# Altium project UHF_QM_REV-A.PrjPcb
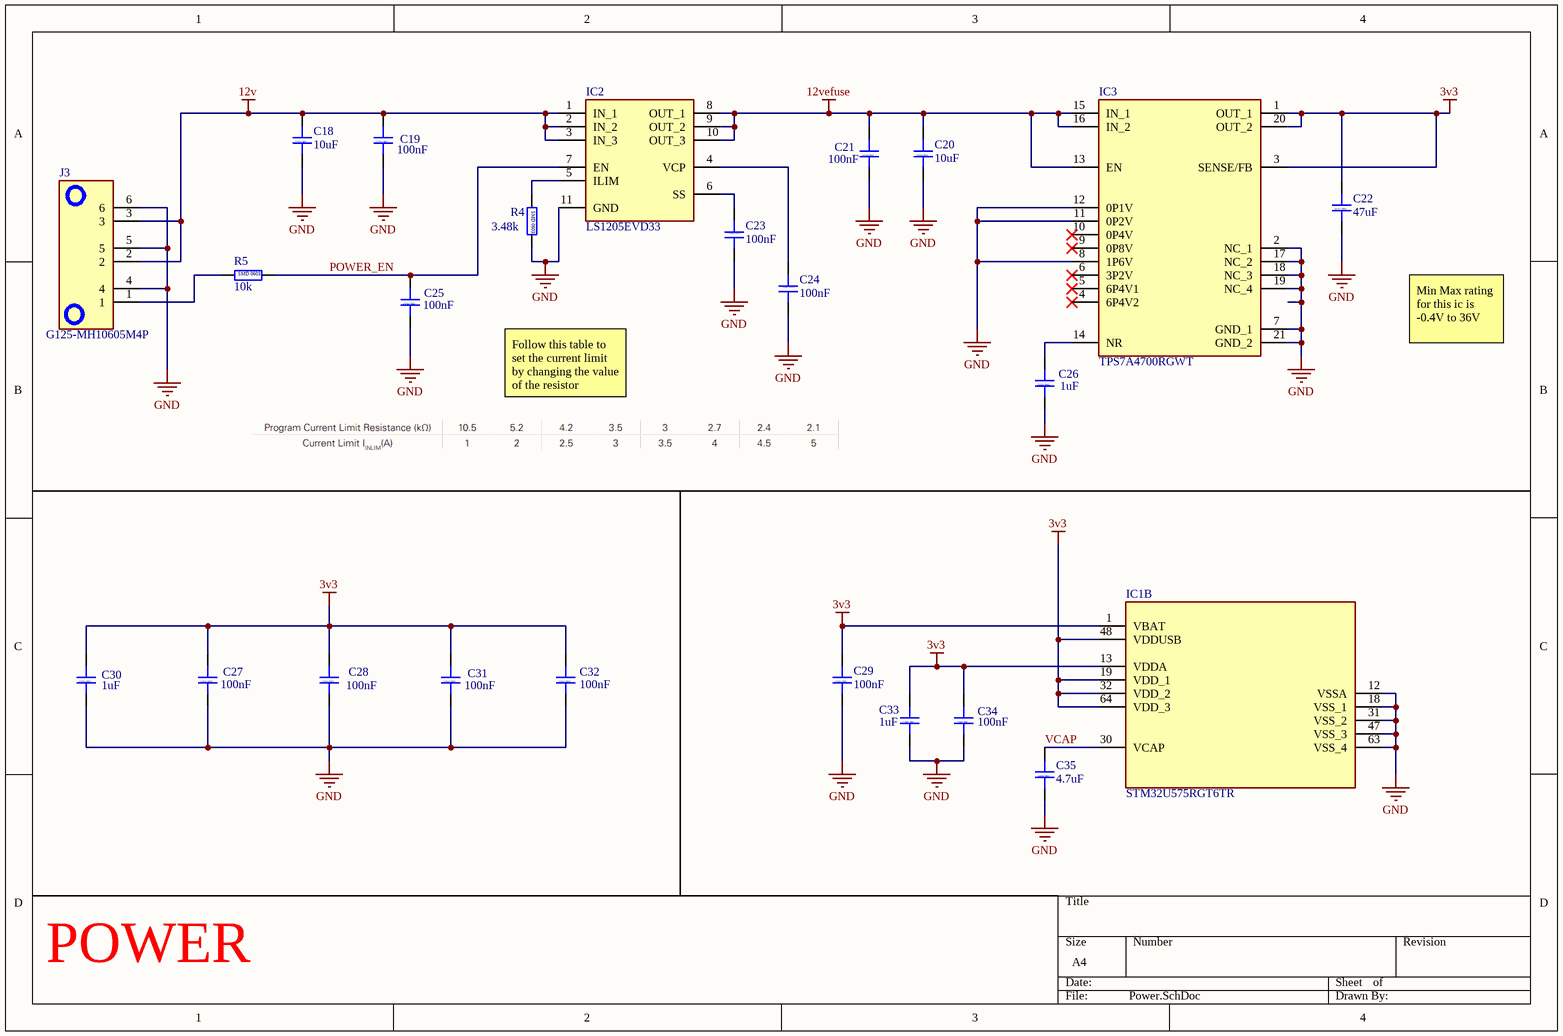
[diagram p0:  Power.SchDoc]
7 sheets, 108 parts. Net scope: global (net labels, ports and power ports of the same name join across sheets).
Board file:  UHF-EM.PcbDoc
Sheets:
   Power.SchDoc
   Stm32.SchDoc
   FlashNTemp.SchDoc
   Si_Chip.SchDoc
   RFnetwork.SchDoc
   RFswitch.SchDoc
   Peripherals.SchDoc

## Sheet  Power.SchDoc
size A4; SheetNumber: 1; SheetTotal: 8

### Parts
C18  10uF  [CAP_0805]
C19  100nF  [CAP_0603]
C20  10uF  [CAP_0805]
C21  100nF  [CAP_0603]
C22  47uF  [CAP_1210]
C23  100nF  [CAP_0603]
C24  100nF  [CAP_0603]
C25  100nF  [CAP_0603]
C26  1uF  [CAP_0603]
C27  100nF  [CAP_0603]
C28  100nF  [CAP_0603]
C29  100nF  [CAP_0603]
C30  1uF  [CAP_0603]
C31  100nF  [CAP_0603]
C32  100nF  [CAP_0603]
C33  1uF  [CAP_0603]
C34  100nF  [CAP_0603]
C35  4.7uF  [CAP_0603]
IC1  STM32U575RGT6TR  [QFP50P1200X1200X160-64N]  (part B of 2)
IC2  LS1205EVD33  [LS1205EVD33]
IC3  TPS7A4700RGWT  [QFN65P500X500X100-21N-D]
J3  G125-MH10605M4P  [G125-MH10605M4P_1]
R4  3.48k  [RES_0603]
R5  10k  [RES_0603]

### Nets
3v3: C22.2 C27.2 C28.2 C29.2 C30.2 C31.2 C32.2 C33.2 C34.2 IC1.1(VBAT) IC1.13(VDDA) IC1.19(VDD_1) IC1.32(VDD_2) IC1.48(VDDUSB) IC1.64(VDD_3) IC3.1(OUT_1) IC3.3(SENSE/FB) IC3.20(OUT_2)
12v: C18.2 C19.2 IC2.1(IN_1) IC2.2(IN_2) IC2.3(IN_3) J3.2 J3.3
12vefuse: C20.2 C21.2 IC2.8(OUT_1) IC2.9(OUT_2) IC2.10(OUT_3) IC3.13(EN) IC3.15(IN_1) IC3.16(IN_2)
GND: C18.1 C19.1 C20.1 C21.1 C22.1 C23.2 C24.2 C25.1 C26.1 C27.1 C28.1 C29.1 C30.1 C31.1 C32.1 C33.1 C34.1 C35.1 IC1.12(VSSA) IC1.18(VSS_1) IC1.31(VSS_2) IC1.47(VSS_3) IC1.63(VSS_4) IC2.11(GND) IC3.2(NC_1) IC3.7(GND_1) IC3.8(1P6V) IC3.11(0P2V) IC3.12(0P1V) IC3.17(NC_2) IC3.18(NC_3) IC3.19(NC_4) IC3.21(GND_2) J3.4 J3.5 J3.6 R4.2
POWER_EN: C25.2 IC2.7(EN) R5.2
VCAP: C35.2 IC1.30(VCAP)
NetC23_1: C23.1 IC2.6(SS)
NetC24_1: C24.1 IC2.4(VCP)
NetC26_2: C26.2 IC3.14(NR)
NetIC2_5: IC2.5(ILIM) R4.1
NetJ3_1: J3.1 R5.1

Not connected (* = marked no-connect by the designer): IC3 4(6P4V2)* 5(6P4V1)* 6(3P2V)* 9(0P8V)* 10(0P4V)*

### Notes on the sheet
- Min Max rating for this ic is -0.4V to 36V
- Follow this table to set the current limit by changing the value of the resistor
- POWER

### Library data of the parts
C18 C20 = Capacitor-SMD-0805: Capacitor SMD 0805 RATED
C19 C21 C23-C35 = Capacitor-SMD-0603: Capacitor SMD 0603 RATED
C22 = Capacitor-SMD-1210: Capacitor SMD 1210 RATED
IC1 = STM32U575RGT6TR: Integrated Circuit; Manufacturer_Name: STMicroelectronics; Datasheet Link: https://www.st.com/resource/en/datasheet/stm32u575ag.pdf; Height: 1.6mm; Manufacturer_Part_Number: STM32U575RGT6TR; Mouser Part Number: 511-STM32U575RGT6TR; Mouser Price/Stock: https://www.mouser.co.uk/ProductDetail/STMicroelectronics/STM32U575RGT6TR?qs=T%252BzbugeAwjjwoz%252BinJLUwQ%3D%3D; Arrow Part Number: STM32U575RGT6TR; Arrow Price/Stock: https://www.arrow.com/en/products/stm32u575rgt6tr/stmicroelectronics?utm_currency=USD&region=nac
IC2 = LS1205EVD33: Integrated Circuit; Manufacturer_Name: LITTELFUSE; Datasheet Link: https://www.littelfuse.com/media?resourcetype=datasheets&itemid=b40a8809-c1ad-459d-a34c-84532dbddcb7&filename=littelfuse-protection-ic-ls1205exd33--datasheet; Height: 0.8mm; Manufacturer_Part_Number: LS1205EVD33; Mouser Part Number: 576-LS1205EVD33; Mouser Price/Stock: https://www.mouser.co.uk/ProductDetail/Littelfuse/LS1205EVD33?qs=4ASt3YYao0VRtislHe5uQQ%3D%3D; Arrow Part Number: LS1205EVD33; Arrow Price/Stock: https://www.arrow.com/en/products/ls1205evd33/littelfuse?utm_currency=USD&region=nac
IC3 = TPS7A4700RGWR: Integrated Circuit; Manufacturer_Name: Texas Instruments; Datasheet Link: http://www.ti.com/lit/gpn/tps7a47; Height: 1mm; Manufacturer_Part_Number: TPS7A4700RGWR; Mouser Part Number: 595-TPS7A4700RGWR; Mouser Price/Stock: https://www.mouser.co.uk/ProductDetail/Texas-Instruments/TPS7A4700RGWR?qs=b5Ofe9I6AaEq0TfoG6v9lA%3D%3D; Arrow Part Number: TPS7A4700RGWR; Arrow Price/Stock: https://www.arrow.com/en/products/tps7a4700rgwr/texas-instruments?region=nac
J3 = G125-MH10605M4P: Connector; Manufacturer_Name: Harwin; Datasheet Link: https://content.harwin.com/m/667f1be9427fb768/original/DRG-02921-Technical-Drawing-Datasheet-G125-MH1XX05M4P-pdf.pdf; Height: 5.3mm; Manufacturer_Part_Number: G125-MH10605M4P; Mouser Part Number: 855-G125MH1065M4PM4P; Mouser Price/Stock: https://www.mouser.co.uk/ProductDetail/Harwin/G125-MH10605M4P?qs=vHuUswq2%252BswF07IXFR1W6A%3D%3D
R4 R5 = Resistor-SMD-0603: Resistor SMD 0603 RATED

## Sheet  Stm32.SchDoc
size A4; SheetNumber: 2; SheetTotal: 8
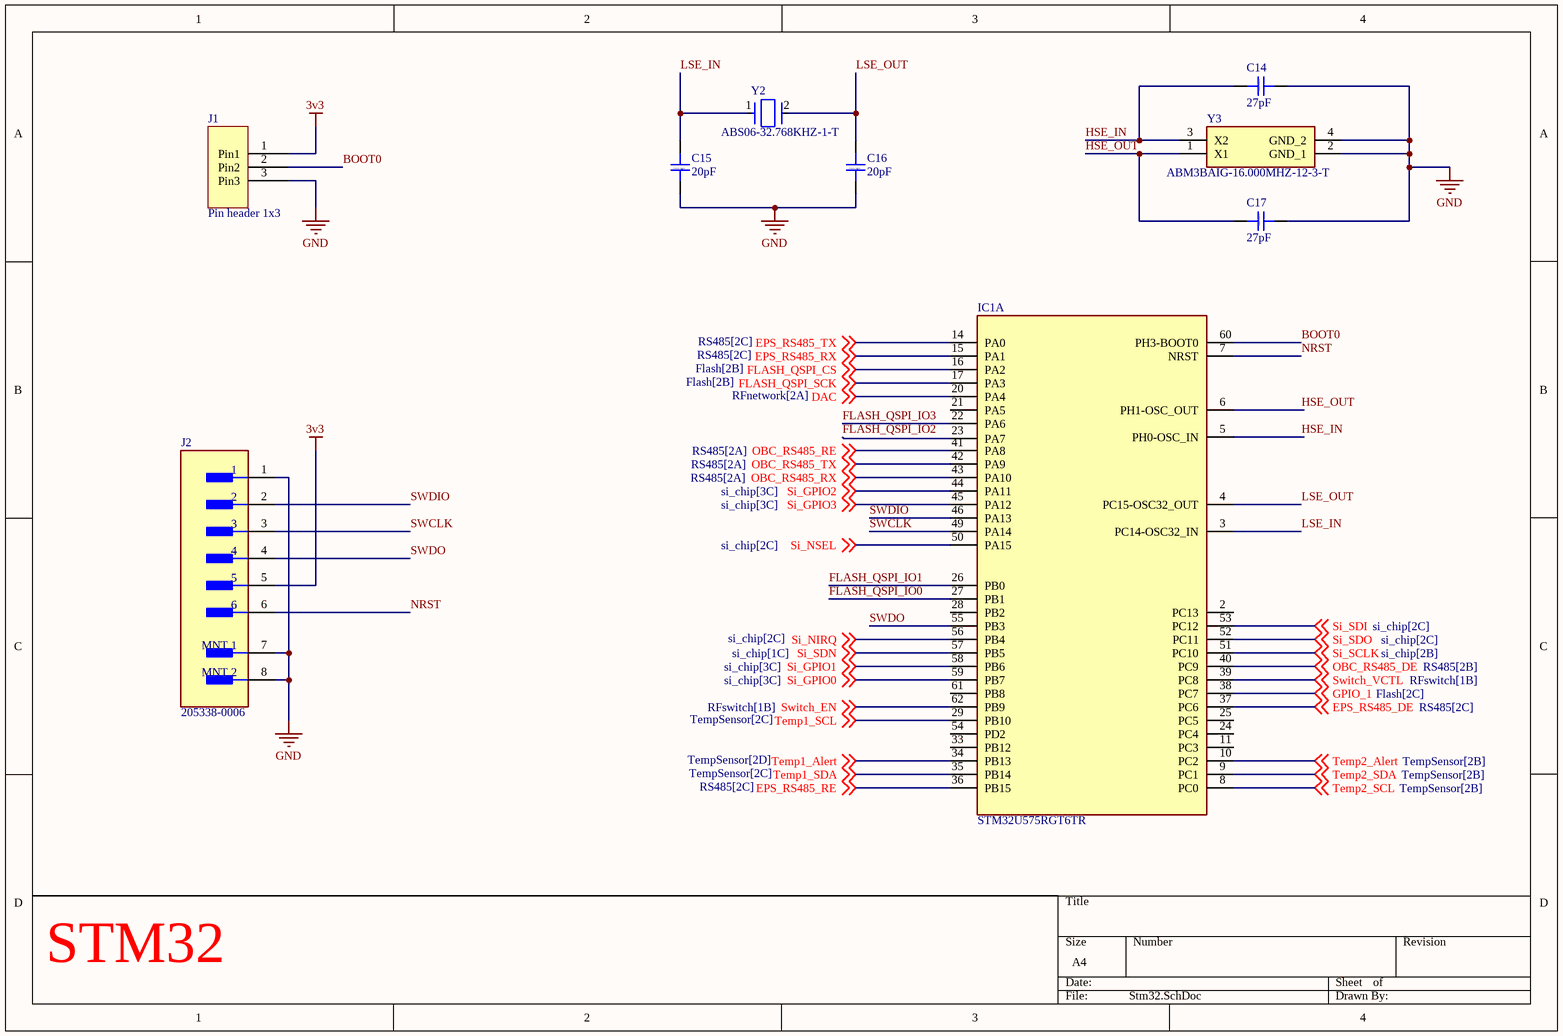
[diagram p1:  Stm32.SchDoc]

### Parts
C14  27pF  [CAP_0603]
C15  20pF  [CAP_0603]
C16  20pF  [CAP_0603]
C17  27pF  [CAP_0603]
IC1  STM32U575RGT6TR  [QFP50P1200X1200X160-64N]  (part A of 2)
J1  Pin header 1x3  [HEADER 3]
J2  205338-0006  [FP-2053380006-MFG]
Y2  ABS06-32.768KHZ-1-T  [FP-ABS06-MFG]
Y3  ABM3BAIG-16.000MHZ-12-3-T  [ABM3BAIG]

### Nets
3v3: J1.1(Pin1) J2.5
GND: C14.2 C15.1 C16.1 C17.2 J1.3(Pin3) J2.1 J2.7(MNT_1) J2.8(MNT_2) Y3.2(GND_1) Y3.4(GND_2)
BOOT0: IC1.60(PH3-BOOT0) J1.2(Pin2)
DAC: IC1.20(PA4) ; off-sheet DAC
EPS_RS485_DE: IC1.37(PC6) ; off-sheet EPS_RS485_DE
EPS_RS485_RE: IC1.36(PB15) ; off-sheet EPS_RS485_RE
EPS_RS485_RX: IC1.15(PA1) ; off-sheet EPS_RS485_RX
EPS_RS485_TX: IC1.14(PA0) ; off-sheet EPS_RS485_TX
FLASH_QSPI_CS: IC1.16(PA2) ; off-sheet FLASH_QSPI_CS
FLASH_QSPI_IO0: IC1.27(PB1)
FLASH_QSPI_IO1: IC1.26(PB0)
FLASH_QSPI_IO2: IC1.23(PA7)
FLASH_QSPI_IO3: IC1.22(PA6)
FLASH_QSPI_SCK: IC1.17(PA3) ; off-sheet FLASH_QSPI_SCK
GPIO_1: IC1.38(PC7) ; off-sheet GPIO_1
HSE_IN: C14.1 IC1.5(PH0-OSC_IN) Y3.3(X2)
HSE_OUT: C17.1 IC1.6(PH1-OSC_OUT) Y3.1(X1)
LSE_IN: C15.2 IC1.3(PC14-OSC32_IN) Y2.1
LSE_OUT: C16.2 IC1.4(PC15-OSC32_OUT) Y2.2
NRST: IC1.7(NRST) J2.6
OBC_RS485_DE: IC1.40(PC9) ; off-sheet OBC_RS485_DE
OBC_RS485_RE: IC1.41(PA8) ; off-sheet OBC_RS485_RE
OBC_RS485_RX: IC1.43(PA10) ; off-sheet OBC_RS485_RX
OBC_RS485_TX: IC1.42(PA9) ; off-sheet OBC_RS485_TX
Si_GPIO0: IC1.59(PB7) ; off-sheet Si_GPIO0
Si_GPIO1: IC1.58(PB6) ; off-sheet Si_GPIO1
Si_GPIO2: IC1.44(PA11) ; off-sheet Si_GPIO2
Si_GPIO3: IC1.45(PA12) ; off-sheet Si_GPIO3
Si_NIRQ: IC1.56(PB4) ; off-sheet Si_NIRQ
Si_NSEL: IC1.50(PA15) ; off-sheet Si_NSEL
Si_SCLK: IC1.51(PC10) ; off-sheet Si_SCLK
Si_SDI: IC1.53(PC12) ; off-sheet Si_SDI
Si_SDN: IC1.57(PB5) ; off-sheet Si_SDN
Si_SDO: IC1.52(PC11) ; off-sheet Si_SDO
SWCLK: IC1.49(PA14) J2.3
SWDIO: IC1.46(PA13) J2.2
SWDO: IC1.55(PB3) J2.4
Switch_EN: IC1.62(PB9) ; off-sheet Switch_EN
Switch_VCTL: IC1.39(PC8) ; off-sheet Switch_VCTL
Temp1_Alert: IC1.34(PB13) ; off-sheet Temp1_Alert
Temp1_SCL: IC1.29(PB10) ; off-sheet Temp1_SCL
Temp1_SDA: IC1.35(PB14) ; off-sheet Temp1_SDA
Temp2_Alert: IC1.10(PC2) ; off-sheet Temp2_Alert
Temp2_SCL: IC1.8(PC0) ; off-sheet Temp2_SCL
Temp2_SDA: IC1.9(PC1) ; off-sheet Temp2_SDA

Not connected (* = marked no-connect by the designer): IC1 2(PC13) 11(PC3) 21(PA5) 24(PC4) 25(PC5) 28(PB2) 33(PB12) 54(PD2) 61(PB8)

### Notes on the sheet
- STM32

### Library data of the parts
C14-C17 = Capacitor-SMD-0603: Capacitor SMD 0603 RATED
IC1 = STM32U575RGT6TR: as IC1 on sheet  Power; Datasheet Link: https://www.st.com/resource/en/datasheet/stm32u575ag.pdf; Height: 1.6mm; Manufacturer_Part_Number: STM32U575RGT6TR; Mouser Part Number: 511-STM32U575RGT6TR; Mouser Price/Stock: https://www.mouser.co.uk/ProductDetail/STMicroelectronics/STM32U575RGT6TR?qs=T%252BzbugeAwjjwoz%252BinJLUwQ%3D%3D; Arrow Part Number: STM32U575RGT6TR; Arrow Price/Stock: https://www.arrow.com/en/products/stm32u575rgt6tr/stmicroelectronics?utm_currency=USD&region=nac
J2 = CMP-00257-108204701-1: 205338-0006 Connector Shrouded Header Positive Lock 6 Position 2mm Pitch Right Angle Surface Mount T/R; Manufacturer Lifecycle Status: ACTIVE; Number of Circuits: 6; Gender: Male; NexarPartId: 108204701; Contact Plating: Gold; Lifecycle Status: Production; Schedule B: 8536694040; RoHS: Compliant; Number of Rows: 1; Country of Origin: MY; Orientation: Right Angle
Y2 = CMP-27762-012387-2: CRYSTAL 32.7680KHZ 12.5PF SMD; Series Resistance: 90kR; Frequency Tolerance: 10ppm; Number of Pins: 2; Max Operating Temperature: 85°C; Load Capacitance: 12.5pF; Series: ABS06; Depth: 1.2mm; Height: 0.6mm; Min Operating Temperature: -40°C; Mount: Surface Mount; Lead Free: Lead Free; Width: 1.2mm; Frequency: 32.768kHz; ESR (Equivalent Series Resistance): 90kR; Termination: SMD/SMT; Packaging: Tape and Reel; RoHS Compliant: Yes; REACH SVHC: No SVHC; Operating Frequency: 32.768 kHz; Case/Package: CSMD; Package Quantity: 3000; Radiation Hardening: No; Tolerance: 10ppm; Length: 2mm
Y3 = ABM3BAIG-16.000MHZ-12-3-T: Crystal or Oscillator; Manufacturer_Name: ABRACON; Datasheet Link: https://abracon.com/AIGcrystals/ABM3BAIG.pdf; Height: 0.9mm; Manufacturer_Part_Number: ABM3BAIG-16.000MHZ-12-3-T

## Sheet  FlashNTemp.SchDoc
size A4; SheetNumber: 3; SheetTotal: 6
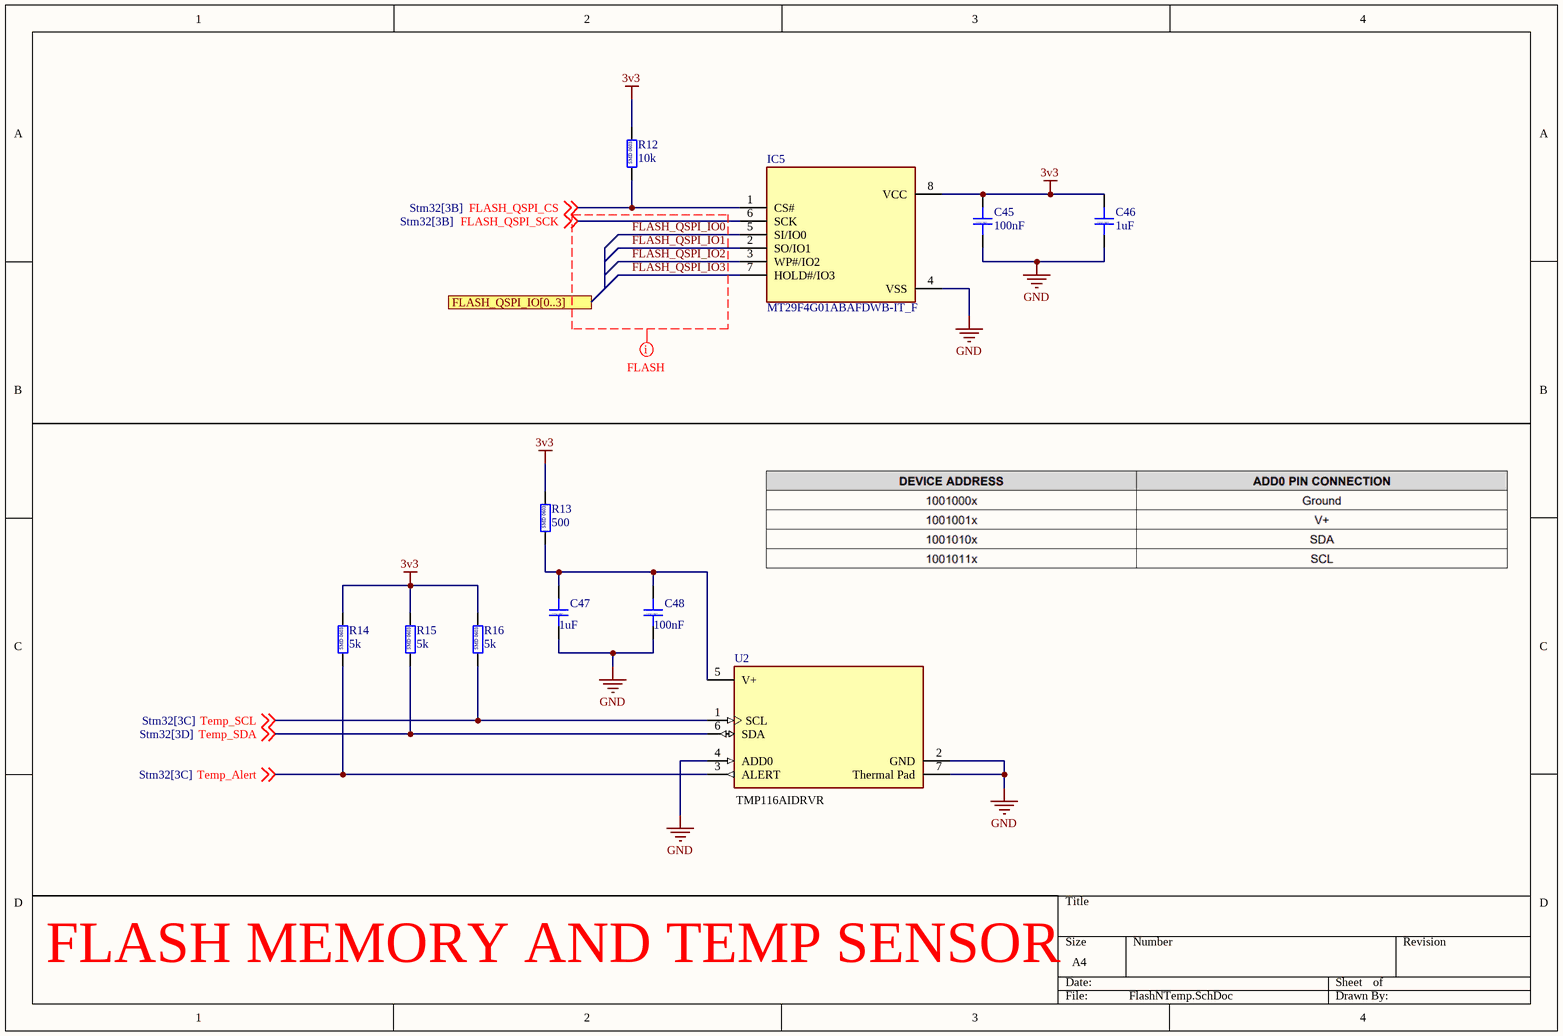
[diagram p2:  FlashNTemp.SchDoc]

### Parts
(Parts that share a designator on the sheet are numbered #1, #2 ... from top to bottom, then left to right.)
C45  100nF  [CAP_0603]
C46  1uF  [CAP_0603]
C47  1uF  [CAP_0603]
C48  100nF  [CAP_0603]
IC5#1  MT29F4G01ABAFDWB-IT_F  [SON127P800X600X65-8N]
R12  10k  [RES_0603]
R13  500  [RES_0603]
R14  5k  [RES_0603]
R15  5k  [RES_0603]
R16  5k  [RES_0603]
U2  (no value)  [FP-DRV0006A-IPC_C]

### Ports
FLASH_QSPI_IO[0..3]

### Nets
3v3: C45.2 C46.2 IC5#1.8(VCC) R12.2 R13.2 R14.2 R15.2 R16.2
GND: C45.1 C46.1 C47.1 C48.1 IC5#1.4(VSS) U2.2(GND) U2.4(ADD0) U2.7(Thermal_Pad)
FLASH_QSPI_CS: IC5#1.1(CS#) R12.1 ; off-sheet FLASH_QSPI_CS
FLASH_QSPI_IO0: IC5#1.5(SI/IO0)
FLASH_QSPI_IO1: IC5#1.2(SO/IO1)
FLASH_QSPI_IO2: IC5#1.3(WP#/IO2)
FLASH_QSPI_IO3: IC5#1.7(HOLD#/IO3)
FLASH_QSPI_SCK: IC5#1.6(SCK) ; off-sheet FLASH_QSPI_SCK
Temp_Alert: R14.1 U2.3(ALERT) ; off-sheet Temp_Alert
Temp_SCL: R16.1 U2.1(SCL) ; off-sheet Temp_SCL
Temp_SDA: R15.1 U2.6(SDA) ; off-sheet Temp_SDA
NetC47_2: C47.2 C48.2 R13.1 U2.5(V+)

### Layout directives
net class FLASH: FLASH_QSPI_IO0, FLASH_QSPI_IO1, FLASH_QSPI_IO2, FLASH_QSPI_IO3, FLASH_QSPI_SCK

### Notes on the sheet
- (near U2) TMP116AIDRVR
- FLASH MEMORY AND TEMP SENSOR

### Library data of the parts
C45-C48 = Capacitor-SMD-0603: Capacitor SMD 0603 RATED
IC5#1 = MT29F4G01ABAFDWB-IT_F: Integrated Circuit; Manufacturer_Name: Micron; Manufacturer_Part_Number: MT29F4G01ABAFDWB-IT:F; Datasheet Link: https://www.farnell.com/datasheets/3151403.pdf; Height: 0.65mm; Mouser Part Number: 340-359563; Mouser Price/Stock: https://www.mouser.co.uk/ProductDetail/Micron/MT29F4G01ABAFDWB-ITF?qs=wUXugUrL1qwrjb7To7JPbA%3D%3D; Arrow Part Number: MT29F4G01ABAFDWB-IT:F; Arrow Price/Stock: null?region=nac
R12-R16 = Resistor-SMD-0603: Resistor SMD 0603 RATED
U2 = CMP-04948-000045-1: SENSOR DIGITAL -55C-125C 6WSON; Resolution: 16b; Output Type: I2C; Mount: Surface Mount; Max Operating Temperature: 150°C; Interface: I2C; RoHS Compliant: Yes; Packaging: Tape and Reel; Min Operating Temperature: -55°C

## Sheet  Si_Chip.SchDoc
size A4; SheetNumber: 4; SheetTotal: 8
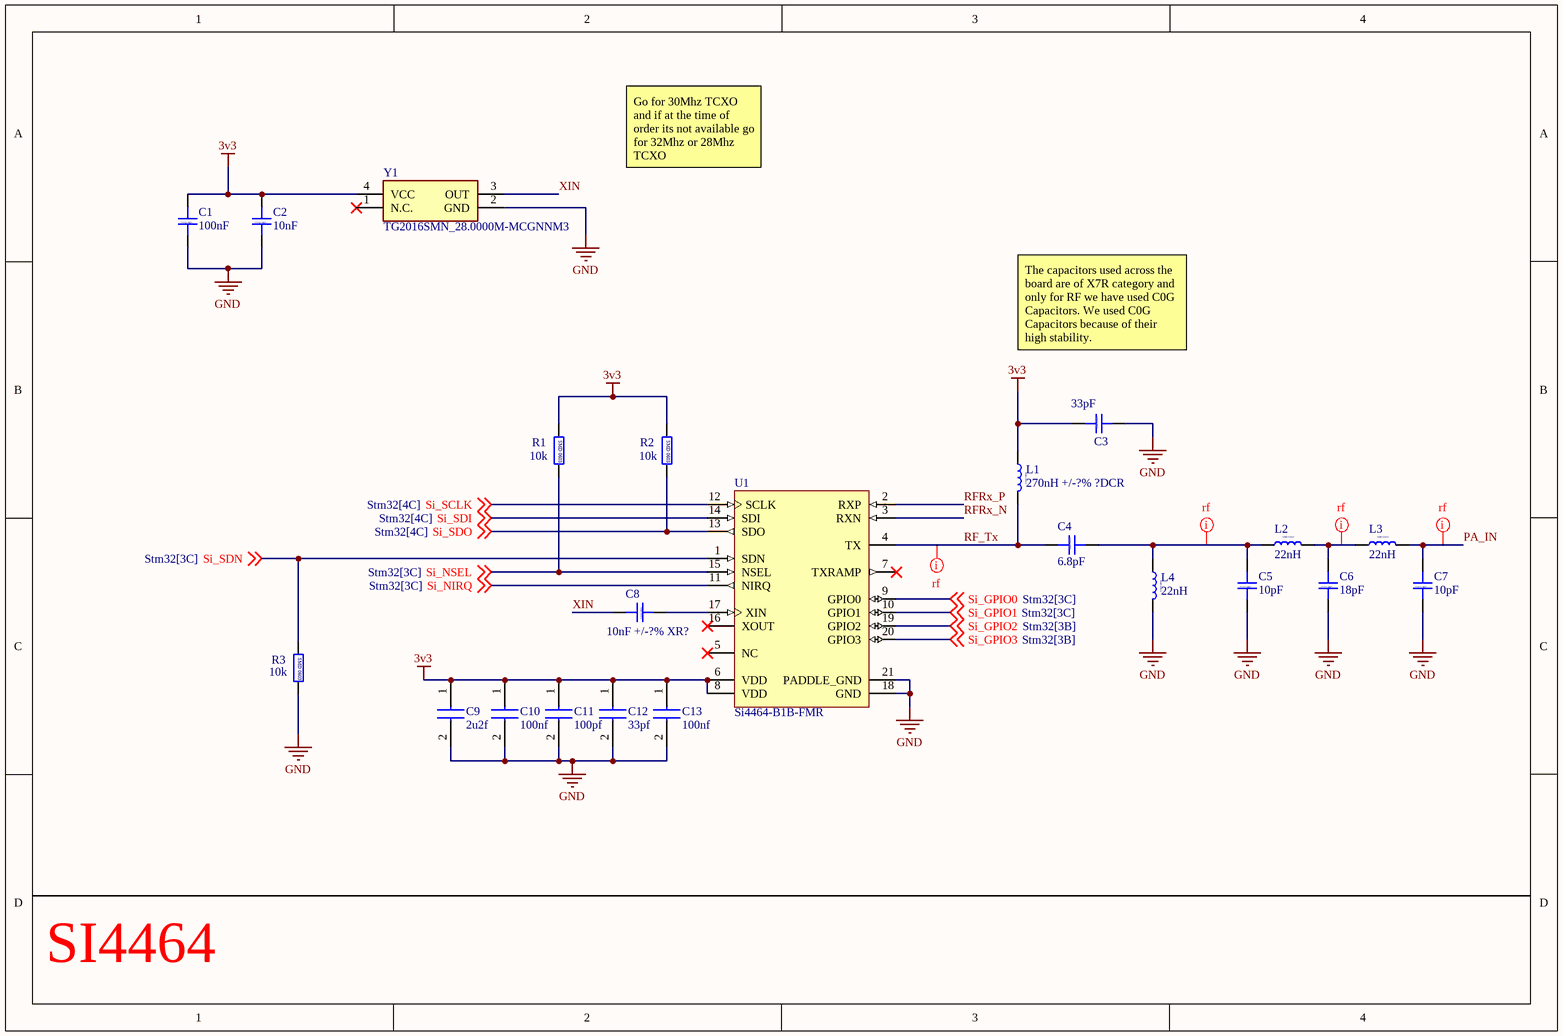
[diagram p3:  Si_Chip.SchDoc]

### Parts
C1  100nF  [CAP_0603]
C2  10nF  [CAP_0603]
C3  33pF  [CAP_0603]
C4  6.8pF  [CAP_0402]
C5  10pF  [CAP_0402]
C6  18pF  [CAP_0402]
C7  10pF  [CAP_0402]
C8  10nF +/-?% XR?  [CAP_0603]
C9  2u2f  [CAPC1608X87N]
C10  100nf  [CAPC1608X87N]
C11  100pf  [CAPC1608X87N]
C12  33pf  [CAPC1608X87N]
C13  100nf  [CAPC1608X87N]
L1  270nH +/-?% ?DCR  [IND_0603]
L2  22nH  [IND_0402]
L3  22nH  [IND_0402]
L4  22nH  [IND_0402]
R1  10k  [RES_0603]
R2  10k  [RES_0603]
R3  10k  [RES_0603]
U1  Si4464-B1B-FMR  [SLAB-QFN-20-2600x2600TP_M]
Y1  TG2016SMN_28.0000M-MCGNNM3  [TG2016SMN250000MMCGNNM3]

### Nets
3v3: C1.2 C2.2 C3.1 C9.1 C10.1 C11.1 C12.1 C13.1 L1.1 R1.1 R2.1 U1.6(VDD) U1.8(VDD) Y1.4(VCC)
GND: C1.1 C2.1 C3.2 C5.1 C6.1 C7.1 C9.2 C10.2 C11.2 C12.2 C13.2 L4.2 R3.2 U1.18(GND) U1.21(PADDLE_GND) Y1.2(GND)
PA_IN: C7.2 L3.2
RF_Tx: C4.1 L1.2 U1.4(TX)
RFRx_N: U1.3(RXN)
RFRx_P: U1.2(RXP)
Si_GPIO0: U1.9(GPIO0) ; off-sheet Si_GPIO0
Si_GPIO1: U1.10(GPIO1) ; off-sheet Si_GPIO1
Si_GPIO2: U1.19(GPIO2) ; off-sheet Si_GPIO2
Si_GPIO3: U1.20(GPIO3) ; off-sheet Si_GPIO3
Si_NIRQ: U1.11(NIRQ) ; off-sheet Si_NIRQ
Si_NSEL: R1.2 U1.15(NSEL) ; off-sheet Si_NSEL
Si_SCLK: U1.12(SCLK) ; off-sheet Si_SCLK
Si_SDI: U1.14(SDI) ; off-sheet Si_SDI
Si_SDN: R3.1 U1.1(SDN) ; off-sheet Si_SDN
Si_SDO: R2.2 U1.13(SDO) ; off-sheet Si_SDO
XIN: C8.2 Y1.3(OUT)
NetC4_2: C4.2 C5.2 L2.1 L4.1
NetC6_2: C6.2 L2.2 L3.1
NetC8_1: C8.1 U1.17(XIN)

Not connected (* = marked no-connect by the designer): U1 5(NC)* 7(TXRAMP)* 16(XOUT)*; Y1 1(N.C.)*

### Layout directives
net class rf: NetC4_2, NetC6_2, PA_IN, RF_Tx

### Notes on the sheet
- Go for 30Mhz TCXO and if at the time of order its not available go for 32Mhz or 28Mhz TCXO
- The capacitors used across the board are of X7R category and only for RF we have used C0G Capacitors. We used C0G Capacitors because of their high stability.
- SI4464

### Library data of the parts
C1-C3 C8 = Capacitor-SMD-0603: Capacitor SMD 0603 RATED
C4-C7 = Capacitor-SMD-0402: Capacitor SMD 0402 RATED
C9-C13 = 0603N470J500CT: Capacitor; Manufacturer_Name: Walsin Technology Corporation; Datasheet Link: https://datasheet.datasheetarchive.com/originals/distributors/DKDS41/DSANUWW0027552.pdf; Height: 0.87mm; Manufacturer_Part_Number: 0603N470J500CT; Mouser Part Number: 791-0603N470J500CT; Mouser Price/Stock: https://www.mouser.co.uk/ProductDetail/Walsin/0603N470J500CT?qs=ZrPdAQfJ6DOWJe9N0xQVbw%3D%3D
L1 = Inductor-SMD-RF-0603: Inductor SMD 0603
L2-L4 = Inductor-SMD-RF-0402: Inductor SMD 0402
R1-R3 = Resistor-SMD-0603: Resistor SMD 0603 RATED
U1 = CMP-0520-00036-1: High-Performance, Low-Current Transceiver, 119 to 960 MHz, -20 to 20 dBm Output Power, -40 to 85 degC, 20-pin QFN, Tape and Reel; Manufacturer: Silicon Labs; Sub-Family: EZRadioPRO; FSK/GFSK: 500 kbps; OOK: 120 kbps; RX Current: 10.6/13.6 mA; ComponentLink3URL: http://www.silabs.com/Support%20Documents/TechnicalDocs/Si4464-63-61-60.pdf; Code_JEDEC: MO-220; PartNumber: Si4464-B1B-FMR; ComponentLink2URL: http://www.silabs.com/Support Documents/TechnicalDocs/Si4464-63-61-60.pdf; Output Power Range: -20 to 20 dBm; Frequency Range: 119 to 960 MHz; DatasheetVersion: Rev. 1.2; Code_IPC: J-STD-020C; Mounting Technology: Surface Mount; PackageDescription: 20-Pin Quad-Flat No-Leads Package, Body 4 x 4 mm, Pitch 0.5 mm; Packing: Tape and Reel; ComponentLink1URL: http://www.silabs.com/; ComponentLink2Description: Datasheet; PackageReference: QFN-20; ComponentLink1Description: Manufacturer URL; ComponentLink3Description: Package Specification
Y1 = TG2016SMN_25.0000M-MCGNNM3: Crystal or Oscillator; Manufacturer_Name: Epson Timing; Manufacturer_Part_Number: TG2016SMN 25.0000M-MCGNNM3; Datasheet Link: https://support.epson.biz/td/api/doc_check.php?dl=app_TG2016SMN&lang=en; Height: 0.73mm; Mouser Part Number: 732-TG216S25MCGNNM3; Mouser Price/Stock: https://www.mouser.co.uk/ProductDetail/Epson-Timing/TG2016SMN-25.0000M-MCGNNM3?qs=d0WKAl%252BL4Ka73EeK48LHvA%3D%3D; Arrow Part Number: TG2016SMN 25.0000M-MCGNNM3; Arrow Price/Stock: https://www.arrow.com/en/products/tg2016smn-25.0000m-mcgnnm3/epson-electronics-america?region=nac

## Sheet  RFnetwork.SchDoc
size A4; SheetNumber: 5; SheetTotal: 8
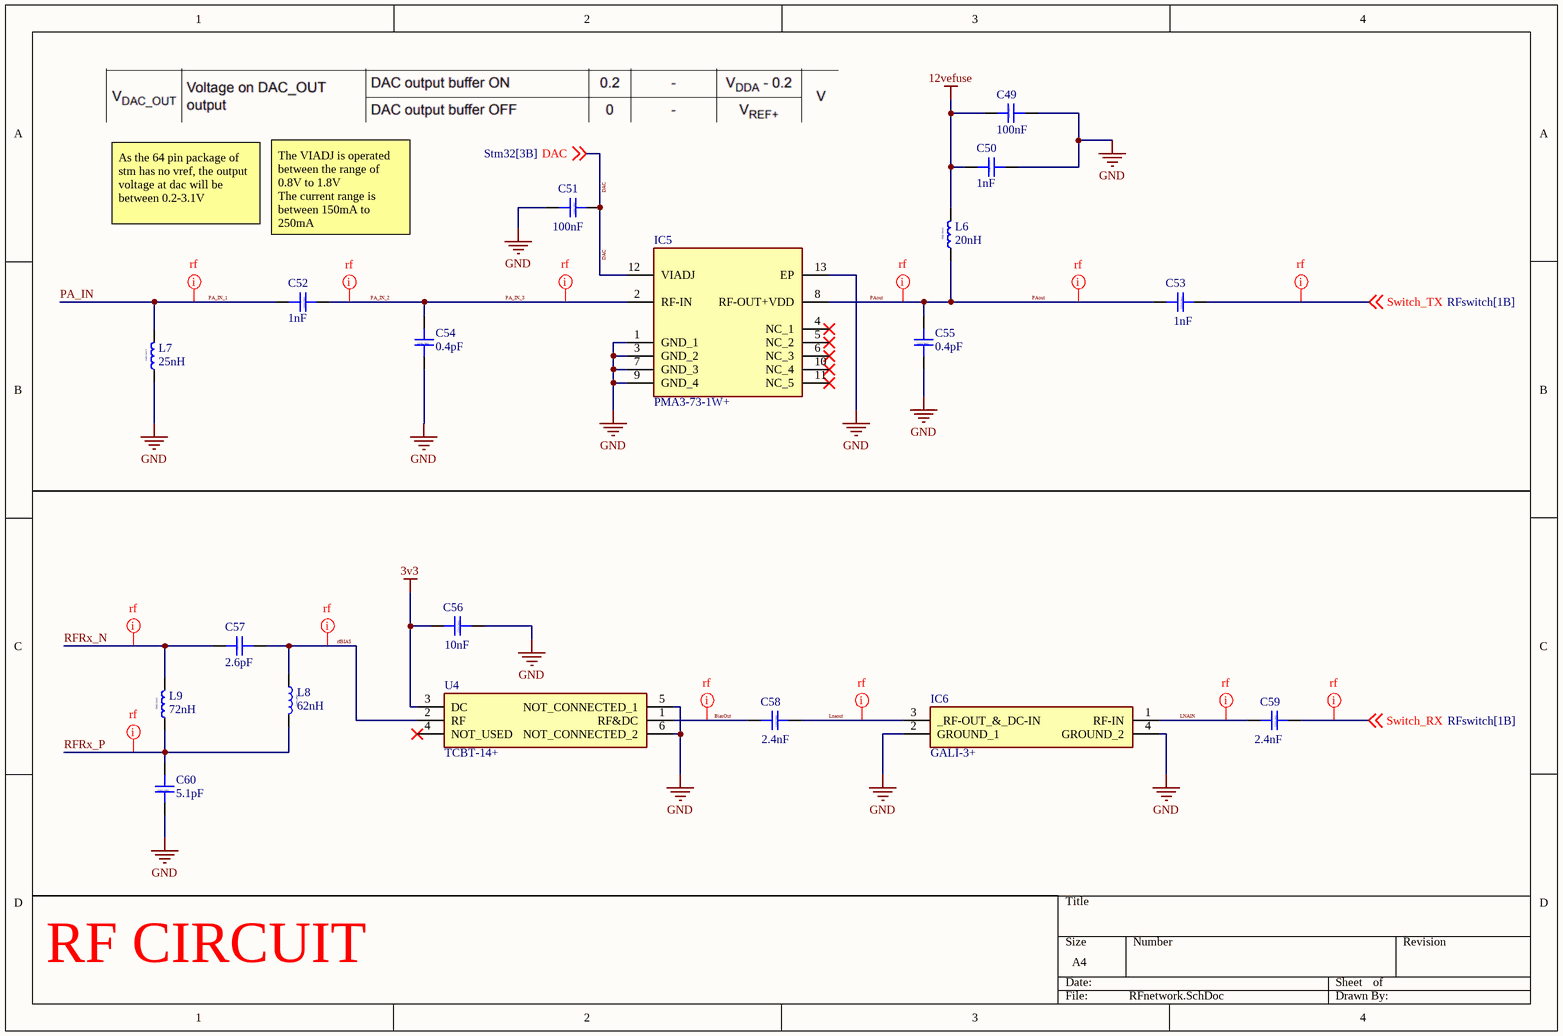
[diagram p4:  RFnetwork.SchDoc]

### Parts
(Parts that share a designator on the sheet are numbered #1, #2 ... from top to bottom, then left to right.)
C49  100nF  [CAP_0603]
C50  1nF  [CAP_0603]
C51  100nF  [CAP_0603]
C52  1nF  [CAP_0603]
C53  1nF  [CAP_0603]
C54  0.4pF  [CAP_0603]
C55  0.4pF  [CAP_0603]
C56  10nF  [CAP_0603]
C57  2.6pF  [CAP_0402]
C58  2.4nF  [CAP_0603]
C59#1  2.4nF  [CAP_0603]
C60  5.1pF  [CAP_0402]
IC5#2  PMA3-73-1W+  [QFN51P300X300X89-13N]
IC6  GALI-3+  [GALI3]
L6  20nH  [IND_0603]
L7  25nH  [IND_0603]
L8  62nH  [IND_0402]
L9  72nH  [IND_0402]
U4  TCBT-14+  [TCBT14bias]

### Nets
3v3: C56.2 U4.3(DC)
12vefuse: C49.1 C50.1 L6.2
GND: C49.2 C50.2 C51.2 C54.1 C55.1 C56.1 C60.1 IC5#2.1(GND_1) IC5#2.3(GND_2) IC5#2.7(GND_3) IC5#2.9(GND_4) IC5#2.13(EP) IC6.2(GROUND_1) IC6.4(GROUND_2) L7.1 U4.5(NOT_CONNECTED_1) U4.6(NOT_CONNECTED_2)
BiasOut: C58.2 U4.1(RF&DC)
DAC: C51.1 IC5#2.12(VIADJ) ; off-sheet DAC
LNAIN: C59#1.2 IC6.1(RF-IN)
Lnaout: C58.1 IC6.3(_RF-OUT_&_DC-IN)
PA_IN: C52.2 L7.2  [also labelled PA_IN_1]
PA_IN_2: C52.1 C54.2 IC5#2.2(RF-IN)  [also labelled PA_IN_3]
PAout: C53.2 C55.2 IC5#2.8(RF-OUT+VDD) L6.1
rfBIAS: C57.2 L8.1 U4.2(RF)
RFRx_N: C57.1 L9.2
RFRx_P: C60.2 L8.2 L9.1
Switch_RX: C59#1.1 ; off-sheet Switch_RX
Switch_TX: C53.1 ; off-sheet Switch_TX

Not connected (* = marked no-connect by the designer): IC5#2 4(NC_1)* 5(NC_2)* 6(NC_3)* 10(NC_4)* 11(NC_5)*; U4 4(NOT_USED)*

### Layout directives
net class rf: BiasOut, LNAIN, Lnaout, PA_IN, PA_IN_2, PAout, rfBIAS, RFRx_N, RFRx_P, Switch_RX, Switch_TX

### Notes on the sheet
- As the 64 pin package of stm has no vref, the output voltage at dac will be between 0.2-3.1V
- The VIADJ is operated between the range of 0.8V to 1.8V
  The current range is between 150mA to 250mA
- RF CIRCUIT

### Library data of the parts
C49-C56 C58 C59#1 = Capacitor-SMD-0603: Capacitor SMD 0603 RATED
C57 C60 = Capacitor-SMD-0402: Capacitor SMD 0402 RATED
IC5#2 = PMA3-73-1W+: Integrated Circuit; Manufacturer_Name: Mini-Circuits; Datasheet Link: https://www.minicircuits.com/WebStore/dashboard.html?model=PMA3-73-1W%2B; Height: 0.89mm; Manufacturer_Part_Number: PMA3-73-1W+
IC6 = GALI-3+: Integrated Circuit; Manufacturer_Name: Mini-Circuits; Datasheet Link: https://www.mouser.com/datasheet/2/1030/GALI-3_2b-1700470.pdf; Height: 1.6mm; Manufacturer_Part_Number: GALI-3+; Mouser Part Number: 139-GALI-3; Mouser Price/Stock: https://www.mouser.co.uk/ProductDetail/Mini-Circuits/GALI-3%2b?qs=xZ%2FP%252Ba9zWqaN9gt7VIItFw%3D%3D
L6 L7 = Inductor-SMD-RF-0603: Inductor SMD 0603
L8 L9 = Inductor-SMD-RF-0402: Inductor SMD 0402
U4 = TCBT-14+: Undefined or Miscellaneous; Manufacturer_Name: Mini-Circuits; Datasheet Link: https://datasheet.datasheetarchive.com/originals/distributors/Datasheets_SAMA/5b6a26293074ceb01a848c930930d1aa.pdf; Height: 3.56mm; Manufacturer_Part_Number: TCBT-14+; Mouser Part Number: 139-TCBT-14; Mouser Price/Stock: https://www.mouser.co.uk/ProductDetail/Mini-Circuits/TCBT-14%2b?qs=xZ%2FP%252Ba9zWqZ8CC6RU0tY5w%3D%3D

## Sheet  RFswitch.SchDoc
size A4; SheetNumber: 6; SheetTotal: 8
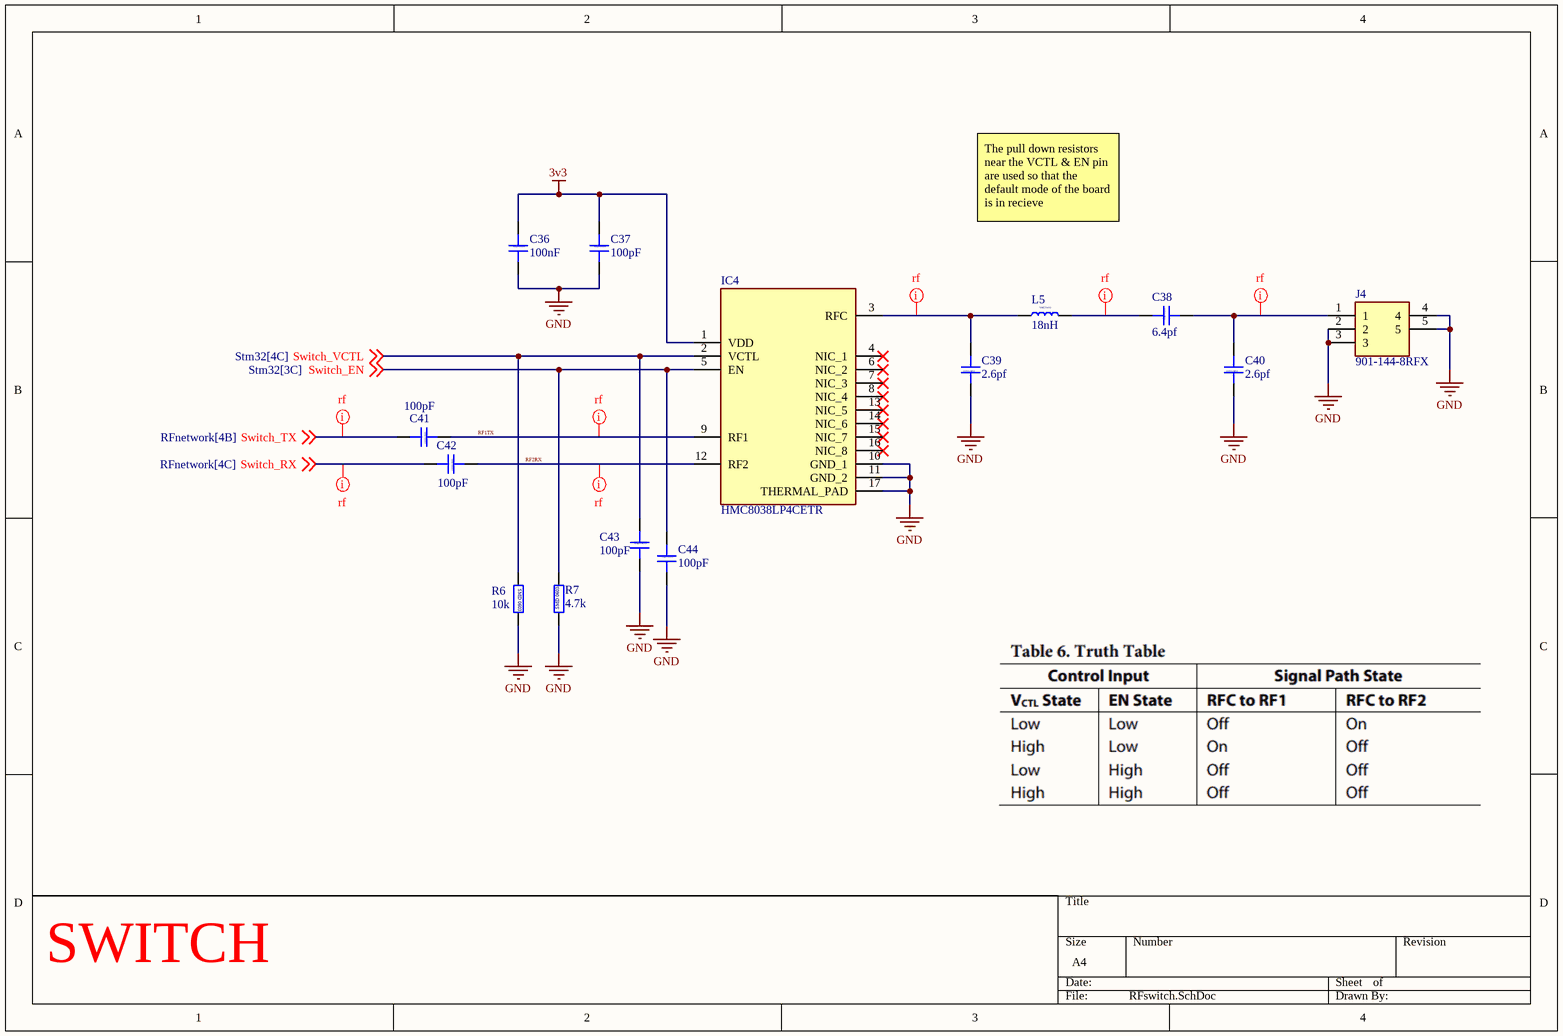
[diagram p5:  RFswitch.SchDoc]

### Parts
C36  100nF  [CAP_0603]
C37  100pF  [CAP_0603]
C38  6.4pf  [CAP_0402]
C39  2.6pf  [CAP_0402]
C40  2.6pf  [CAP_0402]
C41  100pF  [CAP_0603]
C42  100pF  [CAP_0603]
C43  100pF  [CAP_0603]
C44  100pF  [CAP_0603]
IC4  HMC8038LP4CETR  [QFN65P400X400X90-17N-D]
J4  901-144-8RFX  [9011448RFX]
L5  18nH  [IND_0402]
R6  10k  [RES_0603]
R7  4.7k  [RES_0603]

### Nets
3v3: C36.1 C37.1 IC4.1(VDD)
GND: C36.2 C37.2 C39.1 C40.1 C43.2 C44.2 IC4.10(GND_1) IC4.11(GND_2) IC4.17(THERMAL_PAD) J4.2 J4.3 J4.4 J4.5 R6.2 R7.1
RF1TX: C41.1 IC4.9(RF1)
RF2RX: C42.1 IC4.12(RF2)
Switch_EN: C44.1 IC4.5(EN) R7.2 ; off-sheet Switch_EN
Switch_RX: C42.2 ; off-sheet Switch_RX
Switch_TX: C41.2 ; off-sheet Switch_TX
Switch_VCTL: C43.1 IC4.2(VCTL) R6.1 ; off-sheet Switch_VCTL
NetC38_1: C38.1 L5.2
NetC38_2: C38.2 C40.2 J4.1
NetC39_2: C39.2 IC4.3(RFC) L5.1

Not connected (* = marked no-connect by the designer): IC4 4(NIC_1)* 6(NIC_2)* 7(NIC_3)* 8(NIC_4)* 13(NIC_5)* 14(NIC_6)* 15(NIC_7)* 16(NIC_8)*

### Layout directives
net class rf: NetC38_1, NetC38_2, NetC39_2, RF1TX, RF2RX, Switch_RX, Switch_TX

### Notes on the sheet
- The pull down resistors near the VCTL & EN pin are used so that the default mode of the board is in recieve
- SWITCH

### Library data of the parts
C36 C37 C41-C44 = Capacitor-SMD-0603: Capacitor SMD 0603 RATED
C38-C40 = Capacitor-SMD-0402: Capacitor SMD 0402 RATED
IC4 = HMC8038LP4CETR: Integrated Circuit; Manufacturer_Name: Analog Devices; Datasheet Link: https://pt.mouser.com/datasheet/2/609/HMC8038W-2956082.pdf; Height: 0.9mm; Manufacturer_Part_Number: HMC8038LP4CETR; Mouser Part Number: 584-HMC8038LP4CETR; Mouser Price/Stock: https://www.mouser.co.uk/ProductDetail/Analog-Devices/HMC8038LP4CETR?qs=JeIcUl65ClBZnat%2FltI6ww%3D%3D; Arrow Part Number: HMC8038LP4CETR; Arrow Price/Stock: https://www.arrow.com/en/products/hmc8038lp4cetr/analog-devices?region=nac
J4 = 901-144-8RFX: Connector; Manufacturer_Name: Amphenol; Description: AMPHENOL RF - 901-144-8RFX - RF / Coaxial Connector; Datasheet Link: https://componentsearchengine.com/Datasheets/1/901-144-8RFX.pdf; Height: 9.53mm; Manufacturer_Part_Number: 901-144-8RFX; Mouser Part Number: 523-901-144-8RFX; Mouser Price/Stock: https://www.mouser.co.uk/ProductDetail/Amphenol-RF/901-144-8RFX?qs=jpOL8GWAqat%252BbPjbt8toTg%3D%3D; Arrow Part Number: 901-144-8RFX; Arrow Price/Stock: https://www.arrow.com/en/products/901-144-8rfx/amphenol-rf?region=europe
L5 = Inductor-SMD-RF-0402: Inductor SMD 0402
R6 R7 = Resistor-SMD-0603: Resistor SMD 0603 RATED

## Sheet  Peripherals.SchDoc
size A4; SheetNumber: 7; SheetTotal: 7
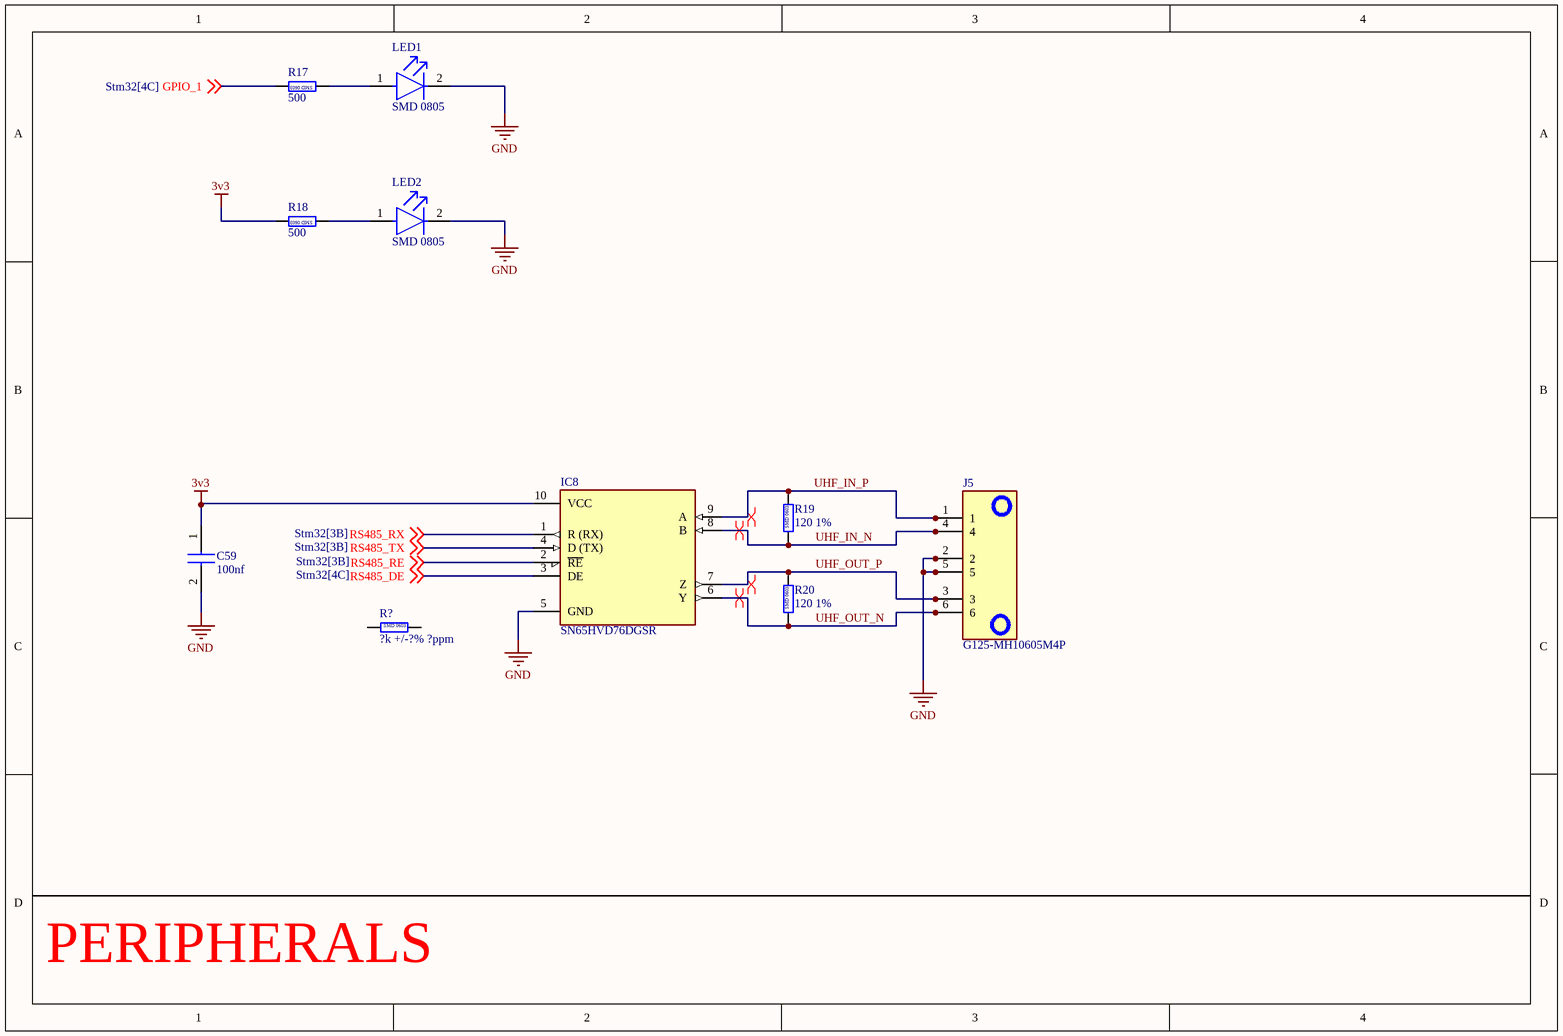
[diagram p6:  Peripherals.SchDoc]

### Parts
(Parts that share a designator on the sheet are numbered #1, #2 ... from top to bottom, then left to right.)
C59#2  100nf  [CAPC1608X87N]
IC8  SN65HVD76DGSR  [SOP50P490X110-10N]
J5  G125-MH10605M4P  [G125-MH10605M4P_1]
LED1  SMD 0805  [FP-SM0805YCL-MFG]
LED2  SMD 0805  [FP-SM0805YCL-MFG]
R17  500  [RES_0603]
R18  500  [RES_0603]
R19  120 1%  [RES_0603]
R20  120 1%  [RES_0603]
R?  ?k +/-?% ?ppm  [RES_0603]

### Nets
3v3: C59#2.1 IC8.10(VCC) R18.2
GND: C59#2.2 IC8.5(GND) J5.2 J5.5 LED1.2(C) LED2.2(C)
GPIO_1: R17.2 ; off-sheet GPIO_1
RS485_DE: IC8.3(DE) ; off-sheet RS485_DE
RS485_RE: IC8.2(~{RE}) ; off-sheet RS485_RE
RS485_RX: IC8.1(R_(RX)) ; off-sheet RS485_RX
RS485_TX: IC8.4(D_(TX)) ; off-sheet RS485_TX
UHF_IN_N: IC8.8(B) J5.4 R19.1
UHF_IN_P: IC8.9(A) J5.1 R19.2
UHF_OUT_N: IC8.6(Y) J5.6 R20.1
UHF_OUT_P: IC8.7(Z) J5.3 R20.2
NetLED1_1: LED1.1(A) R17.1
NetLED2_1: LED2.1(A) R18.1

Not connected (* = marked no-connect by the designer): R? 1 2

### Layout directives
differential pair: UHF_IN_N, UHF_IN_P, UHF_OUT_N, UHF_OUT_P

### Notes on the sheet
- PERIPHERALS

### Library data of the parts
C59#2 = 0603N470J500CT: as C9 on sheet  Si_Chip; Datasheet Link: https://datasheet.datasheetarchive.com/originals/distributors/DKDS41/DSANUWW0027552.pdf; Height: 0.87mm; Manufacturer_Part_Number: 0603N470J500CT; Mouser Part Number: 791-0603N470J500CT; Mouser Price/Stock: https://www.mouser.co.uk/ProductDetail/Walsin/0603N470J500CT?qs=ZrPdAQfJ6DOWJe9N0xQVbw%3D%3D
IC8 = SN65HVD76DGSR: RS485 Full Duplex Transciever; Manufacturer_Name: Texas Instruments; Datasheet Link: http://www.ti.com/lit/gpn/sn65hvd76; Height: 1.1mm; Manufacturer_Part_Number: SN65HVD76DGSR; Mouser Part Number: 595-SN65HVD76DGSR; Mouser Price/Stock: https://www.mouser.co.uk/ProductDetail/Texas-Instruments/SN65HVD76DGSR?qs=7z%252BmIopC6%2FI%252B8LLIzcebYw%3D%3D; Arrow Part Number: SN65HVD76DGSR; Arrow Price/Stock: https://www.arrow.com/en/products/sn65hvd76dgsr/texas-instruments?region=nac
J5 = G125-MH10605M4P: Connector; Manufacturer_Name: Harwin; Datasheet Link: https://content.harwin.com/m/667f1be9427fb768/original/DRG-02921-Technical-Drawing-Datasheet-G125-MH1XX05M4P-pdf.pdf; Height: 5.3mm; Manufacturer_Part_Number: G125-MH10605M4P; Mouser Part Number: 855-G125MH1065M4PM4P; Mouser Price/Stock: https://www.mouser.co.uk/ProductDetail/Harwin/G125-MH10605M4P?qs=vHuUswq2%252BswF07IXFR1W6A%3D%3D
LED1 LED2 = CMP-35283-000007-1: LED YELLOW CLEAR 0805 SMD; Luminous Intensity: 11.5mcd; Test Current: 2mA; Viewing Angle: 130°; Dominant Wavelength: 592nm; Forward Voltage: 1.9V; Lens Color: Colorless; Case Code (Metric): 2012; Illumination Color: Yellow; Length: 2mm; Max Operating Temperature: 80°C; Width: 1.2mm; Case Code (Imperial): 0805; Packaging: Tape and Reel; Lens Transparency: Clear; Mount: Surface Mount; Case/Package: 0805; Forward Current: 2mA; Height: 0.8mm; Lead Free: Lead Free; Min Operating Temperature: -30°C; Color: Yellow; Package Quantity: 4000
R17-R20 R? = Resistor-SMD-0603: Resistor SMD 0603 RATED

## Nets that join several sheets
3v3:  Power (18 pins),  Stm32 (J1.1 J2.5),  FlashNTemp (8 pins),  Si_Chip (14 pins),  RFnetwork (C56.2 U4.3),  RFswitch (C36.1 C37.1 IC4.1),  Peripherals (C59#2.1 IC8.10 R18.2)
12vefuse:  Power (8 pins),  RFnetwork (C49.1 C50.1 L6.2)
GND:  Power (37 pins),  Stm32 (10 pins),  FlashNTemp (8 pins),  Si_Chip (16 pins),  RFnetwork (17 pins),  RFswitch (15 pins),  Peripherals (6 pins)
DAC:  Stm32 (IC1.20),  RFnetwork (C51.1 IC5#2.12)
FLASH_QSPI_CS:  Stm32 (IC1.16),  FlashNTemp (IC5#1.1 R12.1)
FLASH_QSPI_IO0:  Stm32 (IC1.27),  FlashNTemp (IC5#1.5)
FLASH_QSPI_IO1:  Stm32 (IC1.26),  FlashNTemp (IC5#1.2)
FLASH_QSPI_IO2:  Stm32 (IC1.23),  FlashNTemp (IC5#1.3)
FLASH_QSPI_IO3:  Stm32 (IC1.22),  FlashNTemp (IC5#1.7)
FLASH_QSPI_SCK:  Stm32 (IC1.17),  FlashNTemp (IC5#1.6)
GPIO_1:  Stm32 (IC1.38),  Peripherals (R17.2)
PA_IN:  Si_Chip (C7.2 L3.2),  RFnetwork (C52.2 L7.2)
RFRx_N:  Si_Chip (U1.3),  RFnetwork (C57.1 L9.2)
RFRx_P:  Si_Chip (U1.2),  RFnetwork (C60.2 L8.2 L9.1)
Si_GPIO0:  Stm32 (IC1.59),  Si_Chip (U1.9)
Si_GPIO1:  Stm32 (IC1.58),  Si_Chip (U1.10)
Si_GPIO2:  Stm32 (IC1.44),  Si_Chip (U1.19)
Si_GPIO3:  Stm32 (IC1.45),  Si_Chip (U1.20)
Si_NIRQ:  Stm32 (IC1.56),  Si_Chip (U1.11)
Si_NSEL:  Stm32 (IC1.50),  Si_Chip (R1.2 U1.15)
Si_SCLK:  Stm32 (IC1.51),  Si_Chip (U1.12)
Si_SDI:  Stm32 (IC1.53),  Si_Chip (U1.14)
Si_SDN:  Stm32 (IC1.57),  Si_Chip (R3.1 U1.1)
Si_SDO:  Stm32 (IC1.52),  Si_Chip (R2.2 U1.13)
Switch_EN:  Stm32 (IC1.62),  RFswitch (C44.1 IC4.5 R7.2)
Switch_RX:  RFnetwork (C59#1.1),  RFswitch (C42.2)
Switch_TX:  RFnetwork (C53.1),  RFswitch (C41.2)
Switch_VCTL:  Stm32 (IC1.39),  RFswitch (C43.1 IC4.2 R6.1)